# Altium schematic sheet PWRSUPPLY.SchDoc
size A
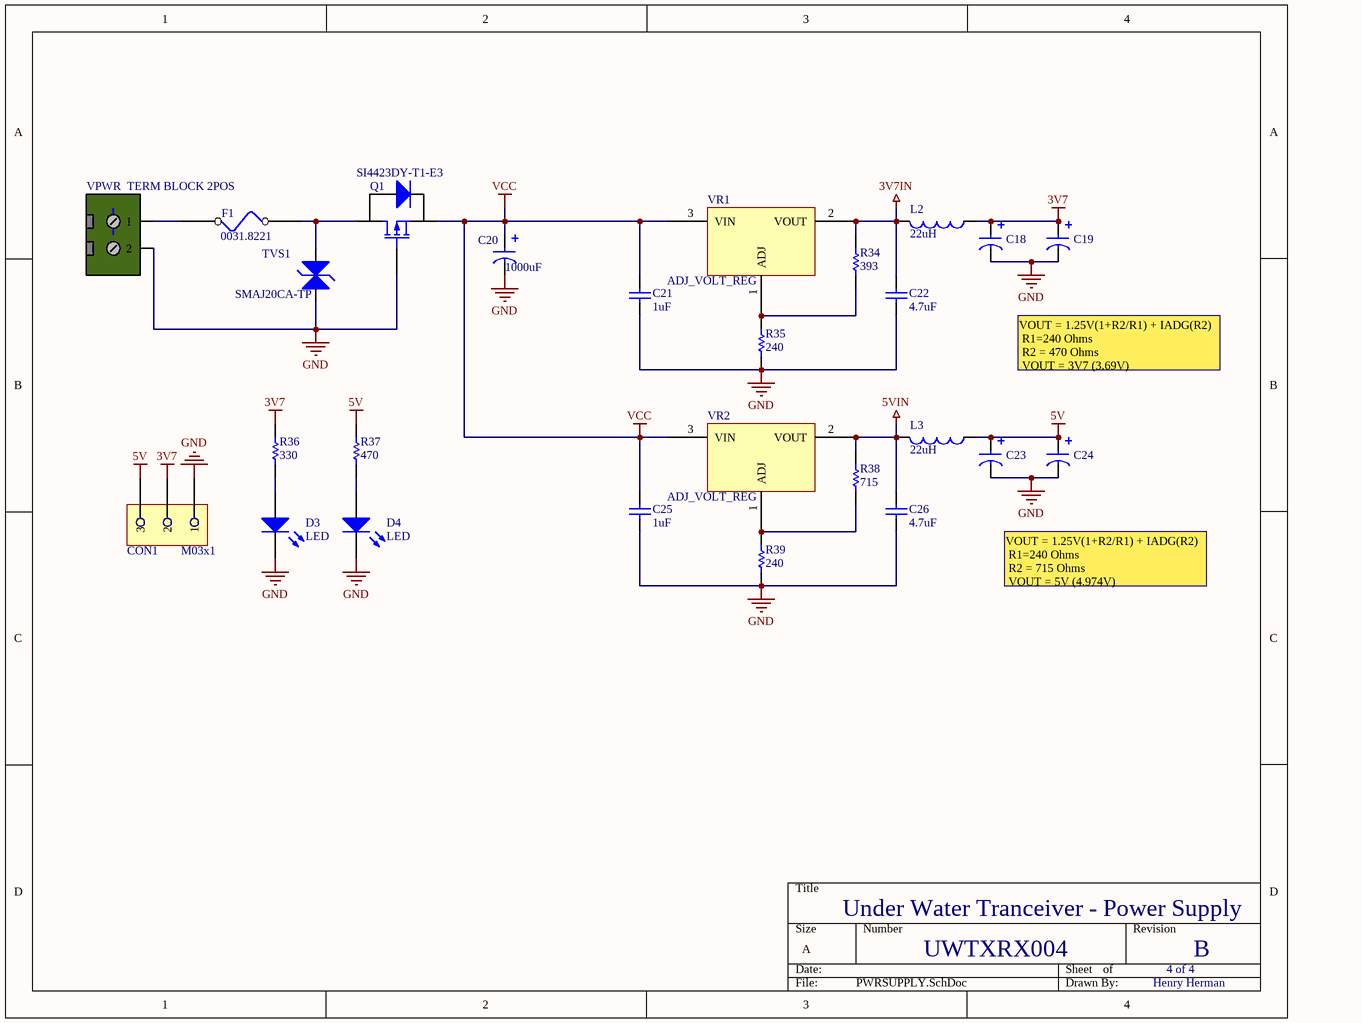
[diagram p0: PWRSUPPLY.SchDoc]

## Parts
C18  CAP_POL  [SM/C_POL_0805]  (value not drawn)
C19  CAP_POL  [SM/C_POL_0805]  (value not drawn)
C20  Label: 1000uF  [CAP-CAN-SMD-POL-12.5mmDia]  (hidden comment: CAP_POL)
C21  value 1uF  [SM/C_0805]  (hidden comment: CAP)
C22  value 4.7uF  [SM/C_0805]  (hidden comment: CAP)
C23  CAP_POL  [SM/C_POL_0805]  (value not drawn)
C24  CAP_POL  [SM/C_POL_0805]  (value not drawn)
C25  value 1uF  [SM/C_0805]  (hidden comment: CAP)
C26  value 4.7uF  [SM/C_0805]  (hidden comment: CAP)
CON1  M03x1  [M03x1]
D3  LED  [LED-0805]
D4  LED  [LED-0805]
F1  0031.8221  [SCHURTER/SMD/2 PADS/0031.8221]
L2  22uH  [G_JMETRIC/TDK/SLE10145]
L3  22uH  [G_JMETRIC/TDK/SLE10145]
Q1  SI4423DY-T1-E3  [SOIC-8-Lead-Vishay-PFET]
R34  value 393  [SM/R_0805]  (hidden comment: Res)
R35  value 240  [SM/R_0805]  (hidden comment: Res)
R36  value 330  [SM/R_0805]  (hidden comment: Res)
R37  value 470  [SM/R_0805]  (hidden comment: Res)
R38  value 715  [SM/R_0805]  (hidden comment: Res)
R39  value 240  [SM/R_0805]  (hidden comment: Res)
TVS1  SMAJ20CA-TP  [D0-214AC]
VPWR  TERM BLOCK 2POS  [Conn-ScrewTerminal-2pin-Phoenix]
VR1  ADJ_VOLT_REG  [LM317-SOT233-POS-ADJ-VOLT_REG]
VR2  ADJ_VOLT_REG  [LM317-SOT233-POS-ADJ-VOLT_REG]

## Nets
3V7: C18.1 C19.1 CON1.2 L2.1 R36.1
3V7IN: C22.2 L2.2 R34.2 VR1.2(VOUT)
5V: C23.1 C24.1 CON1.3 L3.1 R37.1
5VIN: C26.2 L3.2 R38.1 VR2.2(VOUT)
GND: C18.2 C19.2 C20.2 C21.1 C22.1 C23.2 C24.2 C25.1 C26.1 CON1.1 D3.2(K) D4.2(K) Q1.G R35.1 R39.1 TVS1.C VPWR.2
VCC: C20.1 C21.2 C25.2 Q1.S VR1.3(VIN) VR2.3(VIN)
NetD3_1: D3.1(A) R36.2
NetD4_1: D4.1(A) R37.2
NetF1_1: F1.1 VPWR.1
NetF1_2: F1.2 Q1.D TVS1.A
NetR34_1: R34.1 R35.2 VR1.1(ADJ)
NetR38_2: R38.2 R39.2 VR2.1(ADJ)

## Notes on the sheet
- VOUT = 1.25V(1+R2/R1) + IADG(R2)
  R1=240 Ohms
  R2 = 470 Ohms
  VOUT = 3V7 (3.69V)
- VOUT = 1.25V(1+R2/R1) + IADG(R2)
  R1=240 Ohms
  R2 = 715 Ohms
  VOUT = 5V (4.974V)
- Under Water Tranceiver - Power Supply
- UWTXRX004
- 4 of 4
- B
- Henry Herman

## Library data of the parts
C18 C19 C23 C24 = CAP_POL: CAP; Label: 1uF
C20 = CAP_POL: CAP
F1 = 2105: FUSEHOLDER BLACK FOR SMD 5X20MM; mfrName: Schurter Inc; Extra_Description: Standard Package == 100 / Category == Circuit Protection / Family == Fuseholders / Series == OGN / Type == Holder / Fuse Size == 5mm x 20mm / Number of Circuits == 1 / Mounting Type == Surface Mount / Termination Style == Surface Mount (SMD,SMT) / Voltage == 500V / Current Rating == 10A / Material == Copper Alloy, Tin Plated / Catalog Page == 2139 (US2010 Interactive) / Other Names == 0031.8221-ND486-1260; Obsolete: False; Temp_Max: 0; Type: Fuseholders; TypeNotes: Added 12/11/2010 2:44:25 PM; PartID: 2105; mfrPartNum: 0031.8221; URL_Image: HTTP://MEDIA.DIGIKEY.COM/PHOTOS/SCHURTER%20PHOTOS/0031.8221.JPG; URL_Datasheet: http://www.schurterinc.com/var/schurter/storage/ilcatalogue/files/document/datasheet/en/pdf/typ_OGN-SMD.pdf; Date_Created: 12/11/2010 2:47:02 PM; Date_LastModified: 12/11/2010 2:47:02 PM; Verified: False; RoHS: True; Temp_Min: 0
L2 L3 = 1660: INDUCTOR SHIELD PWR 22UH 10145; mfrName: TDK Corporation; mfrPartNum: SLF10145T-220M1R9-PF; Extra_Description: TDK Corporation / Inductance22µH / Tolerance±20% / SeriesSLF / Package / Case10.1mm x 10.1mm x 4.5mm / PackagingCut Tape (CT) / TypeFerrite Core / Current1.9A / Lead Free StatusLead Free / RoHS StatusRoHS Compliant / Other Names445-1981-1; Type: Fixed; PartID: 1660; URL_Datasheet: http://www.digikey.com/scripts/DkSearch/dksus.dll?Pname?Name=445-1981-1-ND&Site=US; Date_Created: 4/21/2006 2:20:33 PM; Date_LastModified: 8/21/2009 1:12:56 AM; Verified: False
Q1 = 2390: mosfet,p ch,20v,10a,8soic; transistor polarity:p channel;; mfrName: Vishay; Extra_Description: MOSFET,P CH,20V,10A,8SOIC; Transistor Polarity:P Channel; Drain Source Voltage Vds:-20V; On Resistance Rds(on):6mohm; Rds(on) Test Voltage Vgs:-4.5V; Operating Temperature Range:-55°C to +150°C; Transistor Case Style:SOIC; No. of Pins:8; SVHC:No SVHC (15-Dec-2010); Current Id Max:-10A; Power Dissipation Pd:1.5W; Voltage Vgs Max:-8V / Polarity: ``P-Channel`` / Case / Package: ``SO-8`` / Packaging: ``Reel`` / Lead-Free Status: ``Lead Free`` / RoHS: ``Compliant`` / Id [Continuous Drain Current]: { / ``uncertainty_minus``: null, / ``value``: -14.0, / ``uncertainty_plus``: null / } / Rds [Drain to Source Resistance] (on): { / ``uncertainty_minus``: null, / ``value``: 0.0075, / ``uncertainty_plus``: null / } / Vds [Drain to Source Voltage]: { / ``uncertainty_minus``: null, / ``value``: -20.0, / ``uncertainty_plus``: null / } / Power Dissipation: { / ``uncertainty_minus``: null, / ``value``: 1.5, / ``uncertainty_plus``: null / } / Breakdown Voltage [Gate to Source]: { / ``max_value``: 8.0, / ``max_uncertainty_plus``: null, / ``min_value``: -8.0, / ``min_uncertainty_plus``: null, / ``max_uncertainty_minus``: null / } / Number of Pins: 8; Obsolete: False; Temp_Max: 0; Type: All Parts; TypeNotes: Applies to all parts in the database; PartID: 2390; mfrPartNum: SI4423DY-T1-E3; URL_Image: http://cdn.sigma.octopart.com/9542269/image/Vishay-SI4423DY-T1-E3.jpg; URL_Datasheet: http://datasheet.octopart.com/SI4423DY-T1-E3-Vishay-datasheet-8542980.pdf; Date_Created: 8/20/2011 8:24:30 AM; Date_LastModified: 8/20/2011 8:24:30 AM; Verified: False; RoHS: True; Temp_Min: 0
R34-R39 = Res: Resistor; Published: 8-Jun-2000; LatestRevisionDate: 17-Jul-2002; LatestRevisionNote: Re-released for DXP Platform.; PackageReference: AXIAL-0.3; Publisher: Altium Limited
TVS1 = 2519: TVS 400W 12V BIDIRECT SMA; mfrName: Micro Commercial Co.; mfrPartNum: SMAJ12CA-TP; Extra_Description: Datasheets	SMAJ5.0 thru SMAJ440CA / Product Photos	SMA, DO-214AC BIDIRECT / Product Training Modules	Transient Voltage Suppressors / Diode Handling and Mounting / Catalog Drawings	SMA Series Top / Featured Product	Surface Mount TVS / Standard Package	1 / Category	Circuit Protection / Family	TVS - Diodes / Series	- / Voltage - Reverse Standoff (Typ)	12V / Voltage - Breakdown	13.3V / Power (Watts)	400W / Polarization	Bidirectional / Mounting Type	Surface Mount / Package / Case	DO-214AC, SMA / Supplier Device Package	SMA / Packaging	Cut Tape (CT) / Other Names	SMAJ12CA-TPMSCT; Obsolete: False; Temp_Max: 0; TypeNotes: Applies to all parts in the database; PartID: 2519; URL_Image: http://media.digikey.com/photos/Micro%20Commercial%20Photos/SMAJ8.5CA-TP.JPG; URL_Datasheet: http://61.222.192.61/mccsemi/up_pdf/SMAJ5.0~SMAJ440CA(SMA).pdf; Date_Created: 2/24/2012 10:06:52 PM; Date_LastModified: 2/24/2012 10:06:52 PM; Verified: False; RoHS: True; Temp_Min: 0; Type: All Parts
VPWR = 2Pin-PhoenixTerminalBlock